# EAGLE design Quad_ESC_controller (EAGLE 9.6.2)
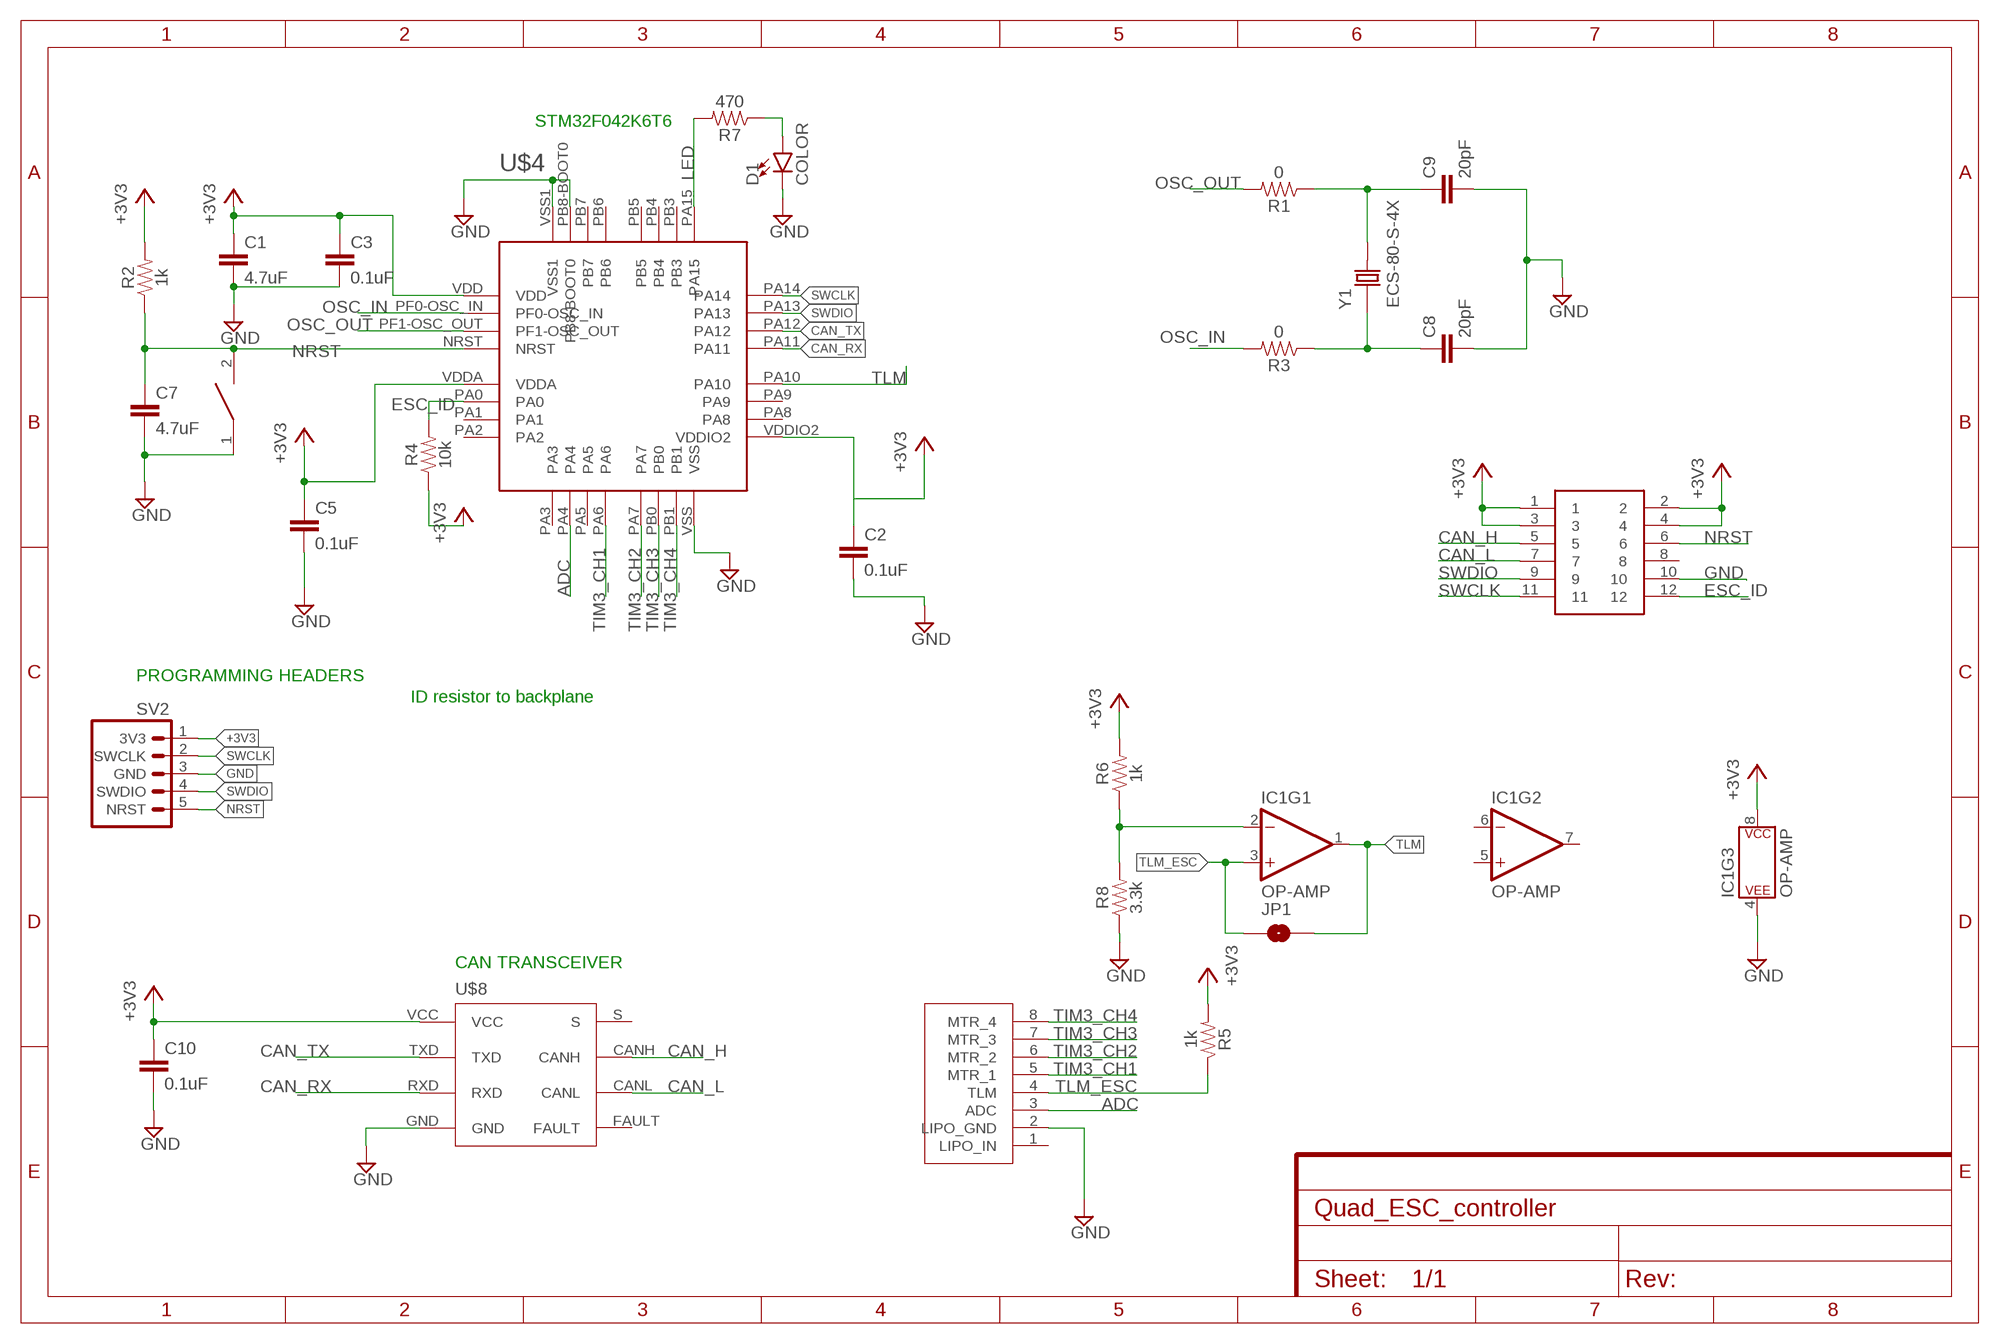
[diagram p0: schematic, sheet 1]

## Parts
C1  4.7uF  4.7UF0603  [0603]
C2  0.1uF  4.7UF0603  [0603]
C3  0.1uF  4.7UF0603  [0603]
C5  0.1uF  4.7UF0603  [0603]
C7  4.7uF  4.7UF0603  [0603]
C8  20pF  4.7UF0603  [0603]
C9  20pF  4.7UF0603  [0603]
C10  0.1uF  4.7UF0603  [0603]
D1  COLOR  LED-0805  [0805]
IC1  OP-AMP  OPAMP-DUALU  [SO08]
JP1  JUMPER-SMT_2_NO_SILK  [SMT-JUMPER_2_NO_SILK]
R1  0  1KOHM-0603-1/10W-1%  [0603]
R2  1k  1KOHM-0603-1/10W-1%  [0603]
R3  0  1KOHM-0603-1/10W-1%  [0603]
R4  10k  10KOHM-0603-1/10W-1%  [0603]
R5  1k  RESISTOR0603  [0603]
R6  1k  RESISTOR0603  [0603]
R7  470  RESISTOR0603  [0603]
R8  3.3k  RESISTOR0603  [0603]
RESET  DISCRETECOMPONENTS_SWITCH  [DISCRETECOMPONENTS_SW_2512]
SV2  3V3 -SWCLK-GND-SWDIO- NRST  SWD_CONN  [1X05]
U$2  JST-8PIN  [8PIN_CONNECTOR]
U$3  BACKPLANE_CONNECTORSESC  [BACKPLANE_CONNECTORS_ESC]
U$4  STM32F042K6T6  [STM32F042K6T6]
U$8  TCAN337D  [TCAN337D]
Y1  ECS-80-S-4X  [XTAL_ECS-80-S-4X]

## Nets
+3V3: C1.1 C2.1 C3.1 C5.1 C10.1 IC1.8(P$V+) R2.2 R4.1 R5.2 R6.2 SV2.1(3V3) U$3.1 U$3.2 U$3.3 U$3.4 U$4.VDD U$4.VDDA U$4.VDDIO2 U$8.VCC
ADC: U$2.3(ADC) U$4.PA4
CAN_H: U$3.5 U$8.CANH
CAN_L: U$3.7 U$8.CANL
CAN_RX: U$4.PA11 U$8.RXD
CAN_TX: U$4.PA12 U$8.TXD
ESC_ID: R4.2 U$3.12 U$4.PA0
GND: C1.2 C2.2 C3.2 C5.2 C7.2 C8.2 C9.2 C10.2 D1.C IC1.4(P$V-) R8.1 RESET.1 SV2.3(GND) U$2.2(LIPO_GND) U$3.10 U$4.PB8-BOOT0 U$4.VSS U$4.VSS1 U$8.GND
LED: R7.2 U$4.PA15
N$1: C9.1 R1.1 Y1.2
N$2: C8.1 R3.1 Y1.1
N$6: IC1.2(-IN) R6.1 R8.2
N$24: D1.A R7.1
NRST: C7.1 R2.1 RESET.2 SV2.5(NRST) U$3.6 U$4.NRST
OSC_IN: R3.2 U$4.PF0-OSC_IN
OSC_OUT: R1.2 U$4.PF1-OSC_OUT
SWCLK: SV2.2(SWCLK) U$3.11 U$4.PA14
SWDIO: SV2.4(SWDIO) U$3.9 U$4.PA13
TIM3_CH1: U$2.5(MTR_1) U$4.PA6
TIM3_CH2: U$2.6(MTR_2) U$4.PA7
TIM3_CH3: U$2.7(MTR_3) U$4.PB0
TIM3_CH4: U$2.8(MTR_4) U$4.PB1
TLM: IC1.1(OUT) JP1.2 U$4.PA10
TLM_ESC: IC1.3(+IN) JP1.1 R5.1 U$2.4(TLM)
Unconnected: IC1.5(+IN) IC1.6(-IN) IC1.7(OUT) U$2.1(LIPO_IN) U$3.8 U$4.PA1 U$4.PA2 U$4.PA3 U$4.PA5 U$4.PA8 U$4.PA9 U$4.PB3 U$4.PB4 U$4.PB5 U$4.PB6 U$4.PB7 U$8.FAULT U$8.S

## Notes on the sheet
- STM32F042K6T6
- PROGRAMMING HEADERS
- ID resistor to backplane
- CAN TRANSCEIVER

## Library data of the parts
C1 C7 = SparkFun-Capacitors:4.7UF: 4.7µF ceramic capacitors A capacitor is a passive two-terminal electrical component used to store electrical energy temporarily in an electric field.; PROD_ID: CAP-08280
C2 C3 C5 C8-C10 = SparkFun-Capacitors:4.7UF: 4.7µF ceramic capacitors A capacitor is a passive two-terminal electrical component used to store electrical energy temporarily in an electric field.; PROD_ID: CAP-08280; VALUE: 4.7uF
D1 = LED, 0805:LED-0805
IC1 = SparkFun-IC-Amplifiers:OPAMP-DUAL: Generic op-amp footprint This component is for the standard 358 pinning of a dual op-amp From the LM358 datasheet: Pin 1: Output A Pin 2: Inverting Input A Pin 3: Non-Inverting Input A Pin 4: Gnd Pin 5: Non-Inverting Input B Pin 6: Inverting Input B Pin 7: Output B Pin 8: V+; PROD_ID: NA-XXXXX
JP1 = SparkFun-Jumpers:JUMPER-SMT_2_NO: Normally open jumper This jumper has two pads in close proximity to each other. Apply solder to close the connection. Round pads are easier to solder for beginners, but are a lot larger. SparkFun Product that uses the round pads: SparkFun EL Sequencer <https://www.sparkfun.com/products/12781>
R1 R3 = SparkFun-Resistors:1KOHM: 1kΩ resistor A resistor is a passive two-terminal electrical component that implements electrical resistance as a circuit element. Resistors act to reduce current flow, and, at the same time, act to lower voltage levels within circuits. - Wikipedia; PROD_ID: RES-07856; VALUE: 1k
R2 = SparkFun-Resistors:1KOHM: 1kΩ resistor A resistor is a passive two-terminal electrical component that implements electrical resistance as a circuit element. Resistors act to reduce current flow, and, at the same time, act to lower voltage levels within circuits. - Wikipedia; PROD_ID: RES-07856
R4 = SparkFun-Resistors:10KOHM: 10kΩ resistor A resistor is a passive two-terminal electrical component that implements electrical resistance as a circuit element. Resistors act to reduce current flow, and, at the same time, act to lower voltage levels within circuits. - Wikipedia; PROD_ID: RES-00824
R5-R8 = SparkFun-Resistors:RESISTOR: Generic Resistor Package
RESET = Push button - FSM2JMTR:DISCRETECOMPONENTS_SWITCH
SV2 = CONN, Serial Wire Programming Headers:SWD_CONN
U$2 = JST 8 pin:JST-8PIN: SM08B-SRSS-TB(LF)(SN)
U$3 = BLHeli_32 45A:BACKPLANE_CONNECTORS: Use samtec TMM and MMS
U$4 = PI_Shield_Library:STM32F042K6T6
U$8 = PI_Shield_Library:TCAN337D
Y1 = ECS-80-S-4X:ECS-80-S-4X: CRYSTAL T/H; DESCRIPTION: Crystal 8MHz Series 2-Pin HC-49/U; DIGI-KEY_PART_NUMBER: X1057-ND; DIGI-KEY_PURCHASE_URL: https://www.digikey.com/product-detail/en/ecs-inc/ECS-80-S-4X/X1057-ND/827549?utm_source=snapeda&utm_medium=aggregator&utm_campaign=symbol; MF: ECS International; MP: ECS-80-S-4X; PACKAGE: HC-49/US ECS International

## Net classes
0 default: width 0.203 mm

## Board
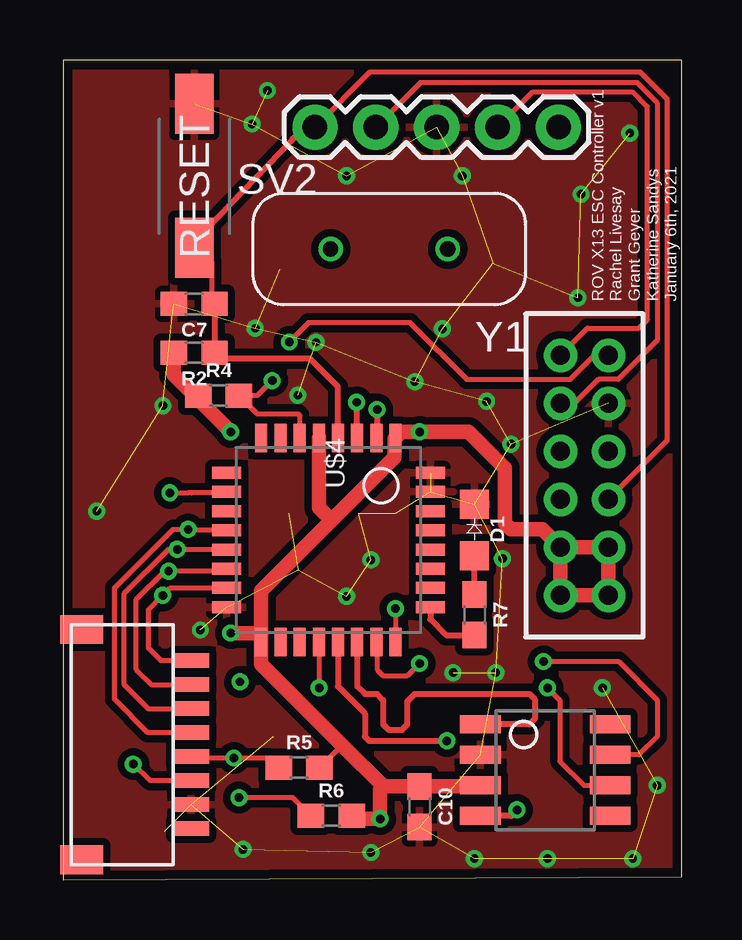
[diagram p1: board, top side]
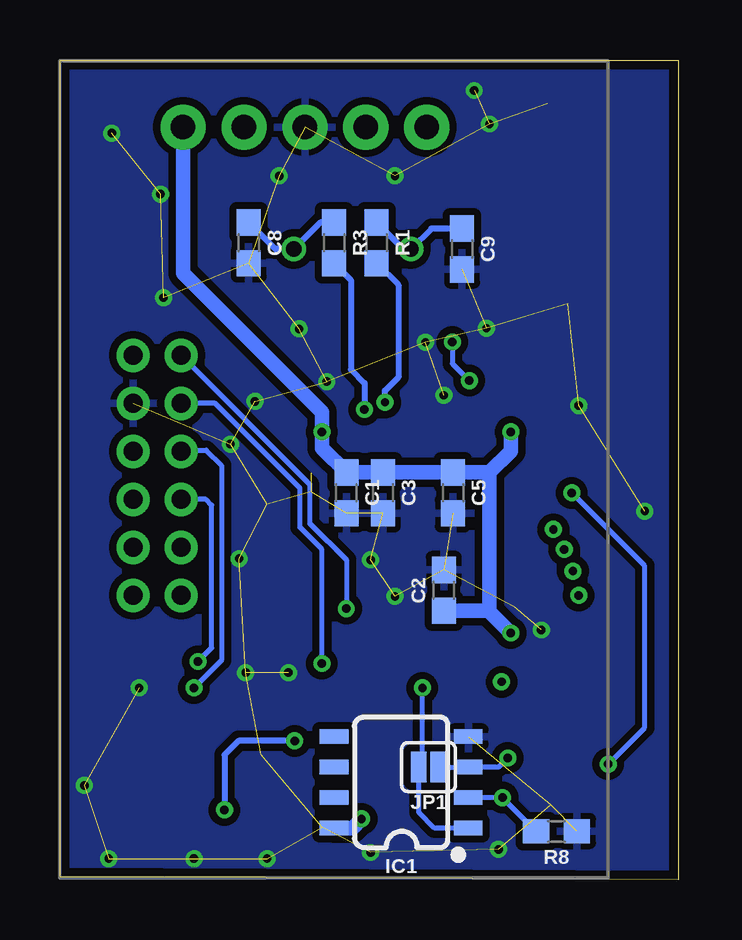
[diagram p2: board, bottom side, seen from below]

Size 25.78 x 34.16 mm. Coordinates in mm from the lower left corner, seen from the top.
Outline: 0,0 25.78,0.13 25.78,34.16 0,34.16 0,0
Copper layers (1*16): Top 0.0356mm / dielectric 1.5011mm / Bottom 0.0356mm
Design rules "ECE_Senior_Design": minimum track width 8mil, minimum drill 13mil, track to track 8mil, track to pad 8mil, pad to pad 6mil, via to via 8mil, smd to smd 6mil, copper to edge 15mil, drill to drill 8mil, minimum pad ring 7mil, minimum via ring 7mil, stop-mask expansion 3mil, vias tented up to drill 0mil, thermal gap 10mil

### Footprints (pad centres in the part's own frame; a part is rotated, then mirrored left to right if it is on the bottom)
0603 = smd 1.1 x 1: 1 -0.85,0; 2 0.85,0
0805 = smd 1.2 x 1.2: A 1.1,0; C -1.05,0
SO08 = smd 0.6 x 1.2: 1 -1.905,-2.8; 2 -0.635,-2.8; 3 0.635,-2.8; 4 1.905,-2.8; 5 1.905,2.8; 6 0.635,2.8; 7 -0.635,2.8; 8 -1.905,2.8
SMT-JUMPER_2_NO_SILK = smd 0.635 x 1.27: 1 -0.406,0; 2 0.406,0
DISCRETECOMPONENTS_SW_2512 = smd 2.5 x 1.6: 1 -3,0; 2 3,0
1X05 = drill 1.016 pad 1.88: 1 0,0; 2 2.54,0; 3 5.08,0; 4 7.62,0; 5 10.16,0
8PIN_CONNECTOR = smd 0.6 x 1.5: 1 1.5,-0.75; 2 2.5,-0.75; 3 3.5,-0.75; 4 4.5,-0.75; 5 5.5,-0.75; 6 6.5,-0.75; 7 7.5,-0.75; 8 8.5,-0.75 | smd 1.2 x 1.8: MECH1 0.2,3.81; MECH2 9.8,3.81
BACKPLANE_CONNECTORS_ESC = drill 0.79 pad 1.39: 1 -1,-5; 2 1,-5; 3 -1,-3; 4 1,-3; 5 -1,-1; 6 1,-1; 7 -1,1; 8 1,1; 9 -1,3; 10 1,3; 11 -1,5; 12 1,5
STM32F042K6T6 = smd 1.2 x 0.5: NRST 0,3.2; PA0 0,1.6; PA1 0,0.8; PA2 0,0; PA8 8.5,0.8; PA9 8.5,1.6; PA10 8.5,2.4; PA11 8.5,3.2; PA12 8.5,4; PA13 8.5,4.8; PA14 8.5,5.6; PF0-OSC_IN 0,4.8; PF1-OSC_OUT 0,4; VDD 0,5.6; VDDA 0,2.4; VDDIO2 8.5,0 | smd 0.5 x 1.2: PA3 1.45,-1.45; PA4 2.25,-1.45; PA5 3.05,-1.45; PA6 3.85,-1.45; PA7 4.65,-1.45; PA15 7.05,7.05; PB0 5.45,-1.45; PB1 6.25,-1.45; PB3 6.25,7.05; PB4 5.45,7.05; PB5 4.65,7.05; PB6 3.85,7.05; PB7 3.05,7.05; PB8-BOOT0 2.25,7.05; VSS 7.05,-1.45; VSS1 1.45,7.05
TCAN337D = smd 1.7 x 0.75: CANH 5.4,2.54; CANL 5.4,1.27; FAULT 5.4,0; GND 0,2.54; RXD 0,0; S 5.4,3.81; TXD 0,3.81; VCC 0,1.27
XTAL_ECS-80-S-4X = drill 0.63 pad 1.03: 1 -2.44,0; 2 2.44,0

### Placement (x,y rotation side)
C1  13.84,16.13 270 bottom
C2  9.78,12.06 90 bottom
C3  12.32,16.13 270 bottom
C5  9.4,16.13 270 bottom
C7  5.46,24 180 top
C8  17.91,26.54 270 bottom
C9  9.02,26.29 270 bottom
C10  14.86,3.05 270 top
D1  17.14,14.61 270 top
IC1  11.56,4.06 90 bottom
JP1  10.41,4.7 180 bottom
R1  12.57,26.54 270 bottom
R2  5.46,21.97 180 top
R3  14.35,26.54 270 bottom
R4  6.48,20.18 0 top
R5  9.83,4.67 0 top
R6  11.18,2.67 0 top
R7  17.14,11.05 270 top
R8  5.08,2.03 180 bottom
RESET  5.46,29.34 270 top
SV2  20.65,31.37 180 top
U$2  4.57,0.64 90 top
U$3  21.73,16.86 0 top
U$4  8.26,18.41 270 top
U$8  17.4,2.67 0 top
Y1  13.59,26.29 180 top

### Tracks (layer width: path | path; a pad name or v marks a point on that pad's centre or on a via)
+3V3  (via drill 0.35)
  Top 0.203: R5.2 11.58,5.58 11.67,5.58
  Top 0.61: U$3.3 U$3.1 U$3.2 U$3.4 U$3.3 | 11.19,14.98 8.26,12.05 8.26,10.29 | 11.19,14.98 13.81,17.61 13.81,18.37 U$4.VDD 14.11,18.67 v14.86,18.67 16.89,18.67 18.41,17.14 18.41,14.86 18.67,14.61 19.98,14.61 U$3.3 | U$4.VDDA 10.65,15.51 11.19,14.98 | 8.26,10.29 v6.99,10.29 | 13.35,3.9 C10.1 17.36,3.9 U$8.VCC | v6.99,18.67 5.63,20.03 | 5.63,20.03 R4.1 | R2.2 4.61,21.04 5.63,20.03 | 13.35,3.9 11.67,5.58 8.26,9 U$4.VDDIO2 8.26,10.29 | R6.2 12.15,2.54 v13.21,2.54 13.21,3.75 13.35,3.9
  Bottom 0.61: v6.99,10.29 7.91,11.21 | v6.99,18.67 6.99,17.87 7.87,16.98 | IC1.8 13.59,2.16 v13.21,2.54 | SV2.1 20.65,25.27 14.86,19.48 v14.86,18.67 14.86,18 C1.1 C3.1 C5.1 7.87,16.98 | 7.91,11.21 C2.1 | 7.87,16.98 7.87,11.25 7.91,11.21
ADC  (via drill 0.35)
  Top 0.203: U$4.PA4 6.77,16.13 5.33,16.13 5.21,16.13 v4.45,16.13 | U$2.3 3.61,4.13 v2.92,4.83
  Bottom 0.203: v2.92,4.83 1.4,6.35 1.4,13.08 v4.45,16.13
CAN_H  (via drill 0.35)
  Top 0.203: v20.02,9.1 23.16,9.1 24.77,7.49 24.77,5.97 24,5.21 U$8.CANH
  Bottom 0.203: v20.02,9.1 19.46,9.67 19.46,15.62 19.69,15.86 U$3.5
CAN_L  (via drill 0.35)
  Top 0.203: v20.19,8 20.7,7.49 20.7,4.95 21.72,3.94 U$8.CANL
  Bottom 0.203: U$3.7 20.68,17.91 19.68,17.91 19.05,17.27 19.05,9.14 v20.19,8
CAN_RX  (via drill 0.35)
  Top 0.254: v18.92,2.92 18.67,2.67 U$8.RXD | U$4.PA11 11.46,8.06 12.57,6.94 12.57,5.97 12.75,5.79 v15.99,5.79
  Bottom 0.254: v15.99,5.79 18.34,5.79 18.92,5.21 v18.92,2.92
CAN_TX
  Top 0.254: U$4.PA12 12.26,8.06 12.57,7.75 13.08,7.75 13.34,7.49 13.34,6.48 13.56,6.25 14.12,6.25 14.35,6.48 14.35,7.44 14.66,7.75 19.43,7.75 19.66,7.52 19.66,6.71 19.43,6.48 U$8.TXD
ESC_ID  (via drill 0.35)
  Top 0.203: U$4.PA0 9.86,19.36 9.79,19.42 8.09,19.42 R4.2 8.09,20.18 v8.71,20.8 | U$3.12 22.14,21.86 21.14,20.86 16.82,20.86 14.46,23.22 10.23,23.22 v9.42,22.41
  Bottom 0.203: v9.42,22.41 9.42,21.51 v8.71,20.8
GND  (via drill 0.35)  (47 unrouted)
  other vias: 1.4,15.37 4.15,19.76 9.78,20.19 8,22.99 10.54,22.4 7.87,31.5 8.51,32.89 11.81,29.34 16.64,29.34 21.59,28.57 23.62,31.11 21.46,24.26 15.81,22.96 14.66,20.76 17.65,19.94 18.67,18.16 18.31,13.39 12.83,13.34 11.81,11.81 16.26,8.64 18.03,8.64 22.48,8 24.77,3.94 23.75,0.89 20.19,0.89 17.14,0.89 5.71,10.41 7.49,1.27 12.83,1.14
  pour Top (isolate 0.305): -0.51,35.69 26.29,35.69 27.81,34.16 27.81,0.64 26.29,-0.89 -0.38,-0.89 -1.65,0.38 -1.65,34.54
  pour Bottom (isolate 0.305): 0.13,35.43 26.04,35.43 27.3,34.16 27.3,0.64 26.29,-0.38 0,-0.38 -1.14,0.76 -1.14,34.16
LED
  Top 0.254: U$4.PA15 15.3,10.86 15.96,10.2 R7.2
N$1
  Bottom 0.254: C9.1 10.3,27.14 Y1.2 11.47,26.29 R1.1
N$2
  Bottom 0.254: R3.1 14.93,27.39 Y1.1 16.8,26.29 C8.1
N$3  (via drill 0.35)
  other vias: 7.37,8.26
N$6  (via drill 0.35)
  Top 0.203: R6.1 9.56,3.43 v7.33,3.43
  Bottom 0.203: R8.2 v7.33,3.43 IC1.2
N$24
  Top 0.254: R7.1 D1.A
NRST
  Top 0.203: RESET.2 6.18,25.78 6.18,24.13 C7.1 | U$3.6 25.17,18.3 25.17,32.55 24.07,33.66 12.78,33.66 SV2.5
  Top 0.254: C7.1 R2.1 6.57,21.72 10.29,21.72 11.46,20.55 U$4.NRST | RESET.2 5.46,26.59 9.56,30.86 10.06,31.37 SV2.5
OSC_IN  (via drill 0.35)
  Top 0.254: v13.09,19.6 13.09,18.45 U$4.PF0-OSC_IN
  Bottom 0.254: v13.09,19.6 v13.08,19.61 13.08,20.7 13.65,21.27 13.65,24.99 R3.2
OSC_OUT  (via drill 0.35)
  Top 0.254: v12.23,19.9 12.23,18.44 U$4.PF1-OSC_OUT
  Bottom 0.254: R1.2 11.67,24.79 11.67,20.94 12.23,20.38 v12.23,19.9
SWCLK  (via drill 0.35)
  Top 0.203: U$3.11 21.86,22.99 24,22.99 24.36,23.34 24.36,32.22 23.76,32.82 19.56,32.82 SV2.2 | v13.84,11.3 13.84,9.93 U$4.PA14
  Bottom 0.203: U$3.11 15.37,16.49 15.37,14.86 13.84,13.34 v13.84,11.3
SWDIO  (via drill 0.35)
  Top 0.203: U$3.9 21.32,19.86 22.32,20.86 23.14,20.86 24.77,22.48 24.77,32.38 23.93,33.22 14.88,33.22 SV2.4 | U$4.PA13 13.08,9.89 13.08,8.76 13.34,8.51 14.35,8.51 v14.86,9.02
  Bottom 0.203: v14.86,9.02 14.86,13.78 15.77,14.69 15.77,16.32 19.3,19.86 U$3.9
TIM3_CH1  (via drill 0.35)
  Top 0.203: U$2.5 3.52,6.13 2.13,7.52 2.13,12.17 4.57,14.61 v5.21,14.61 5.25,14.56 U$4.PA6
TIM3_CH2  (via drill 0.35)
  Top 0.203: U$2.6 3.53,7.13 2.54,8.13 2.54,11.94 4.37,13.77 4.76,13.77 v4.75,13.77 6.8,13.77 U$4.PA7
TIM3_CH3  (via drill 0.35)
  Top 0.203: U$4.PB0 6.7,12.86 v4.39,12.86 4.23,12.86 3.05,11.68 3.05,8.76 3.68,8.13 U$2.7
TIM3_CH4  (via drill 0.35)
  Top 0.203: U$2.8 4.07,9.13 3.56,9.65 3.56,11.26 v4.15,11.85 4.46,12.16 U$4.PB1
TLM  (via drill 0.35)
  Top 0.203: U$4.PA10 v10.67,8
  Bottom 0.203: IC1.1 10.16,2.16 10.82,2.82 JP1.2 10.67,4.85 v10.67,8
TLM_ESC  (via drill 0.35)
  Top 0.203: U$2.4 5.38,5.08 v7.11,5.08 8.57,5.08 R5.1
  Bottom 0.203: v7.11,5.08 7.49,4.7 IC1.3 JP1.1

### Text on the board
tPlace: ROV X13 ESC Controller v1 / Rachel Livesay / Grant Geyer / Katherine Sandys / January 6th, 2021
200bmp: C:/Users/Rach s PC/Desktop/kingsman logo.bmp'